# EasyEDA schematic 1-Schematic_UC2DC-Seg7.json
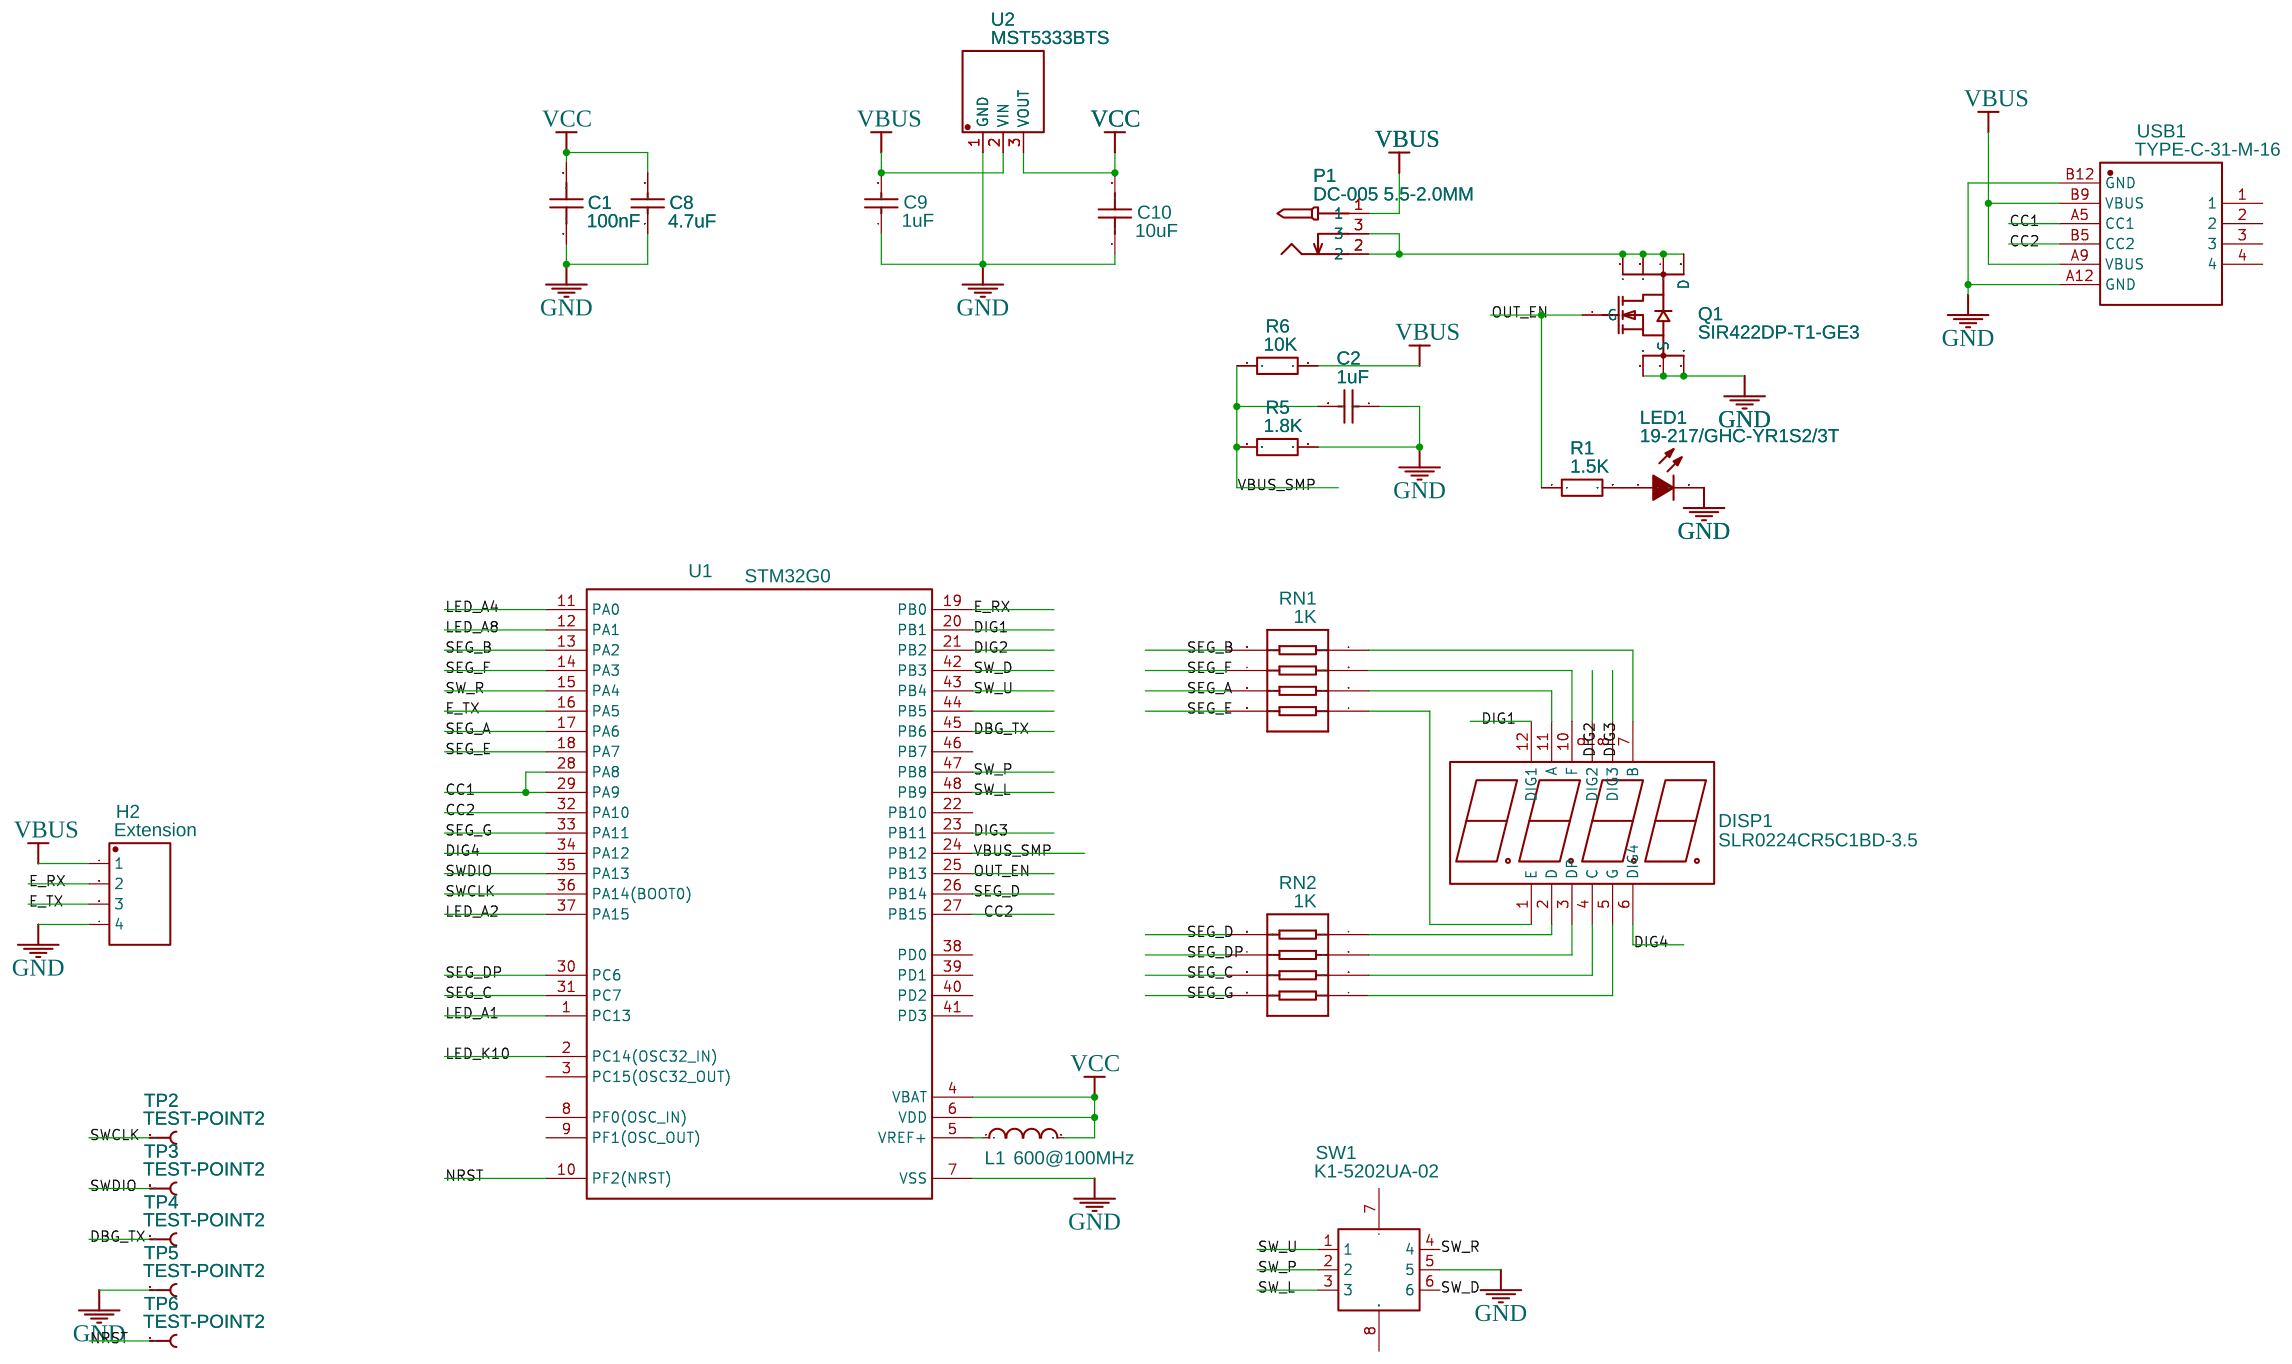
[diagram p0: schematic sheet]

## Parts
C1  100nF  [C_0603_KICAD]
C2  1uF  [C_0603_KICAD]
C8  4.7uF  [C_0603_KICAD]
C9  1uF  [C_0603_KICAD]
C10  10uF  [C_0603_KICAD]
DISP1  SLR0224CR5C1BD-3.5  [LED-SEG-TH_SLR0224CR5C1BD-3.5]
H2  Extension  [210S-1X4P]
L1  600@100MHz  [L_0603]
LED1  19-217/GHC-YR1S2/3T  [LED0603-R-RD]
P1  DC-005 5.5-2.0MM  [DC-005]
Q1  SIR422DP-T1-GE3  [POWERPAK-SO-8_L6.2-W5.2-P1.27-BL-EP]
R1  1.5K  [R0402]
R5  1.8K  [0402]
R6  10K  [0402]
RN1  1K  [RES-ARRAY-SMD_0402-8P-L2.0-W1.0-BL]
RN2  1K  [RES-ARRAY-SMD_0402-8P-L2.0-W1.0-BL]
SW1  K1-5202UA-02  [SMD-7.5X7.5MM]
TP2  TEST-POINT2  [PAD.03X.05]
TP3  TEST-POINT2  [PAD.03X.05]
TP4  TEST-POINT2  [PAD.03X.05]
TP5  TEST-POINT2  [PAD.03X.05]
TP6  TEST-POINT2  [PAD.03X.05]
U1  STM32G0  [LQFP48]
U2  MST5333BTS  [SOT-89-3_L4.5-W2.5-P1.50-LS4.2-BR]
USB1  TYPE-C-31-M-16  [TYPE-C-31-M-16]

## Library data of the parts
C1 = CC0603KRX7R9BB104: Supplier: LCSC; Manufacturer: YAGEO; LCSC Assembly: Yes; Supplier Part: C14663
C2 C9 = CL10A105KB8NNNC: Supplier: LCSC; Manufacturer: SAMSUNG; LCSC Assembly: Yes; Supplier Part: C15849
C8 = CL10A475KO8NNNC: Supplier: LCSC; Manufacturer: SAMSUNG; LCSC Assembly: Yes; Supplier Part: C19666
C10 = CL10A106KP8NNNC: Supplier: LCSC; Manufacturer: SAMSUNG; LCSC Assembly: Yes; Supplier Part: C19702
DISP1 = SLR0224CR5C1BD-3.5: Supplier: LCSC; Supplier Part: C225970; Manufacturer: SUNLIGHT; Contributor: LCSC
H2 = -: Supplier: LCSC; Manufacturer: Ckmtw; Manufacturer Part: 210S-1*4P L=11.6MMGold-plated black; Contributor: LCSC; Supplier Part: C124378
L1 = GZ1608D181TF: Supplier: LCSC; Manufacturer: Sunlord; Supplier Part: C15909
LED1 = 19-217/GHC-YR1S2/3T: Supplier: LCSC; Manufacturer: EVERLIGHT; LCSC Assembly: Yes; image: //image.lceda.cn/szlcsc/C72043.jpg; Supplier Part: C72043; SMT Type: Basic
P1 = -: Supplier: LCSC; Manufacturer: BOOMELE; image: //image.lceda.cn/szlcsc/C16214.jpg; Supplier Part: C16214
Q1 = SIR422DP-T1-GE3: Supplier: LCSC; Manufacturer: VISHAY; image: //image.lceda.cn/szlcsc/C21104.jpg; Supplier Part: C21104; LCSC Assembly: Yes; SMT Type: Extend
R1 = 0402WGF1501TCE: Supplier: LCSC; Manufacturer: UniOhm; LCSC Assembly: Yes; Supplier Part: C25867; SMT Type: Basic
R5 = 0402WGF1801TCE: Supplier: LCSC; Manufacturer: UniOhm; Supplier Part: C25871; LCSC Assembly: Yes
R6 = 0402WGF1002TCE: Supplier: LCSC; Manufacturer: UniOhm; LCSC Assembly: Yes; Supplier Part: C25744
RN1 RN2 = 4D02WGJ0102TCE: Supplier: LCSC; Manufacturer: UniOhm; LCSC Assembly: Yes; Supplier Part: C25726; SMT Type: Basic
SW1 = -: Supplier: LCSC; Manufacturer: HRO; Contributor: LCSC; Supplier Part: C145900
TP2-TP6 = -: Bare copper test points for troubleshooting or ICT; Contributor: SparkFun; Manufacturer Part: ?
U1 = -: Supplier: LCSC; Contributor: z4yx
U2 = -: Supplier: LCSC; Supplier Part: C324582; Manufacturer: MST; Contributor: LCSC; LCSC Assembly: Yes
USB1 = -: Supplier: LCSC; Supplier Part: C283541; Manufacturer: Korean Hroparts Elec; Contributor: LCSC

## Nets
GND: C1.1 C2.1 C8.1 C9.1 C10.1 H2.4 LED1.2(C) Q1.1(S) Q1.2(S) Q1.3(S) R5.2 SW1.5 TP5.P$1(1) U1.7(VSS) U2.1(GND) USB1.A12(GND) USB1.B12(GND)
VBUS: C9.2 H2.1 P1.1 R6.2 U2.2(VIN) USB1.A9(VBUS) USB1.B9(VBUS)
VBUS_SMP: C2.2 R5.1 R6.1 U1.24(PB12)
VCC: C1.2 C8.2 C10.2 L1.2 U1.4(VBAT) U1.6(VDD) U2.3(VOUT)
CC1: U1.28(PA8) U1.29(PA9) USB1.A5(CC1)
CC2: U1.27(PB15) U1.32(PA10) USB1.B5(CC2)
DBG_TX: TP4.P$1(1) U1.45(PB6)
DIG1: DISP1.12(DIG1) U1.20(PB1)
DIG2: DISP1.9(DIG2) U1.21(PB2)
DIG3: DISP1.8(DIG3) U1.23(PB11)
DIG4: DISP1.6(DIG4) U1.34(PA12)
E_RX: H2.2 U1.19(PB0)
E_TX: H2.3 U1.16(PA5)
LED_A1: U1.1(PC13)
LED_A2: U1.37(PA15)
LED_A4: U1.11(PA0)
LED_A8: U1.12(PA1)
LED_K10: U1.2(PC14(OSC32_IN))
NRST: TP6.P$1(1) U1.10(PF2(NRST))
OUT_EN: Q1.4(G) R1.1 U1.25(PB13)
SEG_A: RN1.6 U1.17(PA6)
SEG_B: RN1.8 U1.13(PA2)
SEG_C: RN2.6 U1.31(PC7)
SEG_D: RN2.8 U1.26(PB14)
SEG_DP: RN2.7 U1.30(PC6)
SEG_E: RN1.5 U1.18(PA7)
SEG_F: RN1.7 U1.14(PA3)
SEG_G: RN2.5 U1.33(PA11)
SW_D: SW1.6 U1.42(PB3)
SW_L: SW1.3 U1.48(PB9)
SW_P: SW1.2 U1.47(PB8)
SW_R: SW1.4 U1.15(PA4)
SW_U: SW1.1 U1.43(PB4)
SWCLK: TP2.P$1(1) U1.36(PA14(BOOT0))
SWDIO: TP3.P$1(1) U1.35(PA13)
Net-(DISP1-1): DISP1.1(E) RN1.4
Net-(DISP1-2): DISP1.2(D) RN2.1
Net-(DISP1-3): DISP1.3(DP) RN2.2
Net-(DISP1-4): DISP1.4(C) RN2.3
Net-(DISP1-5): DISP1.5(G) RN2.4
Net-(DISP1-7): DISP1.7(B) RN1.1
Net-(DISP1-10): DISP1.10(F) RN1.2
Net-(DISP1-11): DISP1.11(A) RN1.3
Net-(L1-1): L1.1 U1.5(VREF+)
Net-(LED1-1): LED1.1(A) R1.2
Net-(P1-2): P1.2 P1.3 Q1.5(D) Q1.6(D) Q1.7(D) Q1.8(D)

Not connected (* = marked no-connect by the designer): SW1 7 8; U1 3(PC15(OSC32_OUT)) 8(PF0(OSC_IN)) 9(PF1(OSC_OUT)) 22(PB10) 38(PD0) 39(PD1) 40(PD2) 41(PD3) 44(PB5) 46(PB7); USB1 1 2 3 4
